# Altium schematic sheet AD_3_V1_01.SchDoc
size A2; Date: Date; CompanyName: HESSO; Engineer: Name; Address1: Route du Rawyl 47; Address2: 1950 Sion; Address3: Switzerland; DocumentNumber: 3; SheetNumber: 3; SheetTotal: 6; ProjectName: Project Name
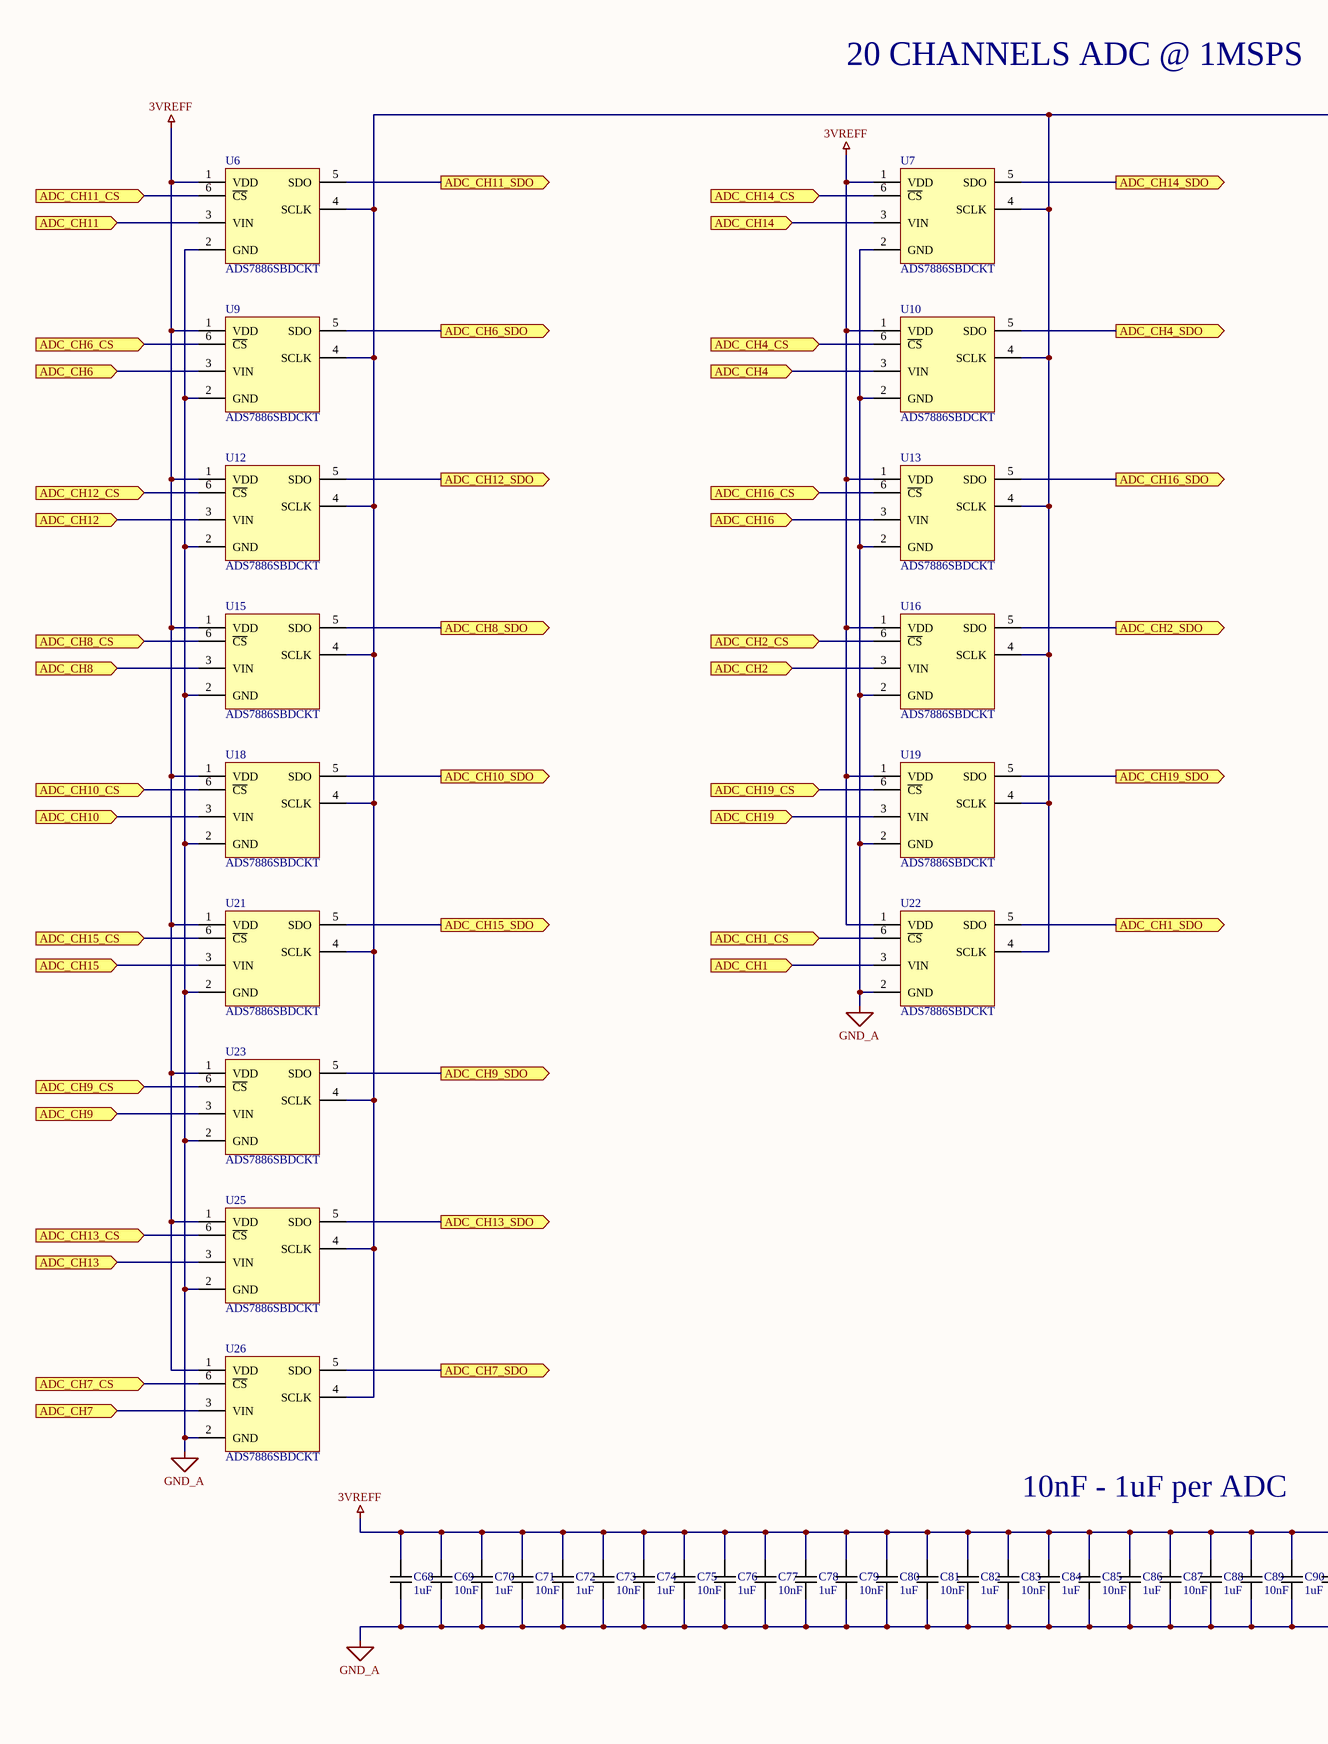
[diagram p0: AD_3_V1_01.SchDoc, left]
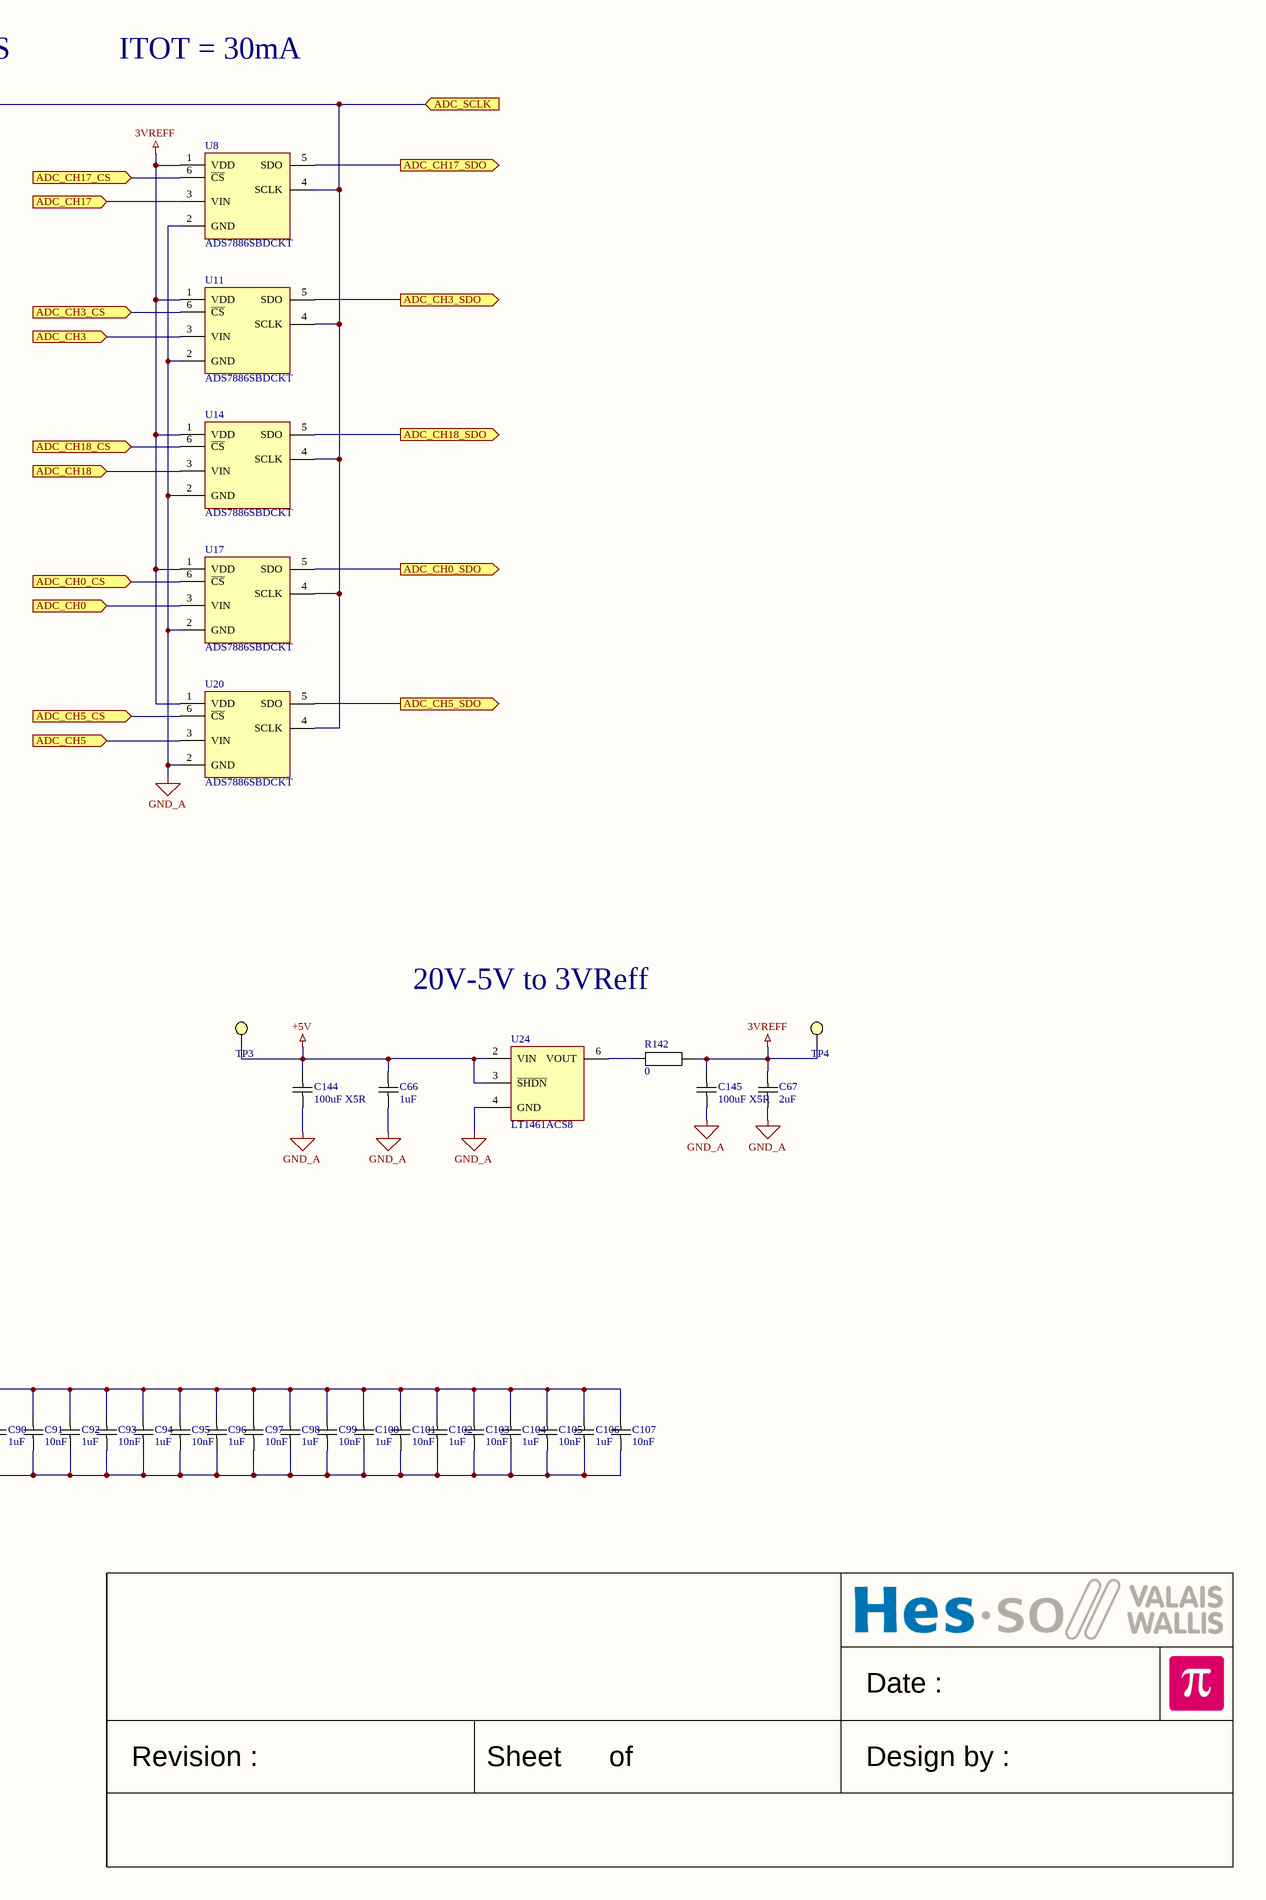
[diagram p1: AD_3_V1_01.SchDoc, right]

## Parts
C66  1uF  [CAPACITOR 1608 REFLOW]
C67  2uF  [CAPACITOR 1608 REFLOW]
C68  1uF  [CAPACITOR 1608 REFLOW]
C69  10nF  [CAPACITOR 1608 REFLOW]
C70  1uF  [CAPACITOR 1608 REFLOW]
C71  10nF  [CAPACITOR 1608 REFLOW]
C72  1uF  [CAPACITOR 1608 REFLOW]
C73  10nF  [CAPACITOR 1608 REFLOW]
C74  1uF  [CAPACITOR 1608 REFLOW]
C75  10nF  [CAPACITOR 1608 REFLOW]
C76  1uF  [CAPACITOR 1608 REFLOW]
C77  10nF  [CAPACITOR 1608 REFLOW]
C78  1uF  [CAPACITOR 1608 REFLOW]
C79  10nF  [CAPACITOR 1608 REFLOW]
C80  1uF  [CAPACITOR 1608 REFLOW]
C81  10nF  [CAPACITOR 1608 REFLOW]
C82  1uF  [CAPACITOR 1608 REFLOW]
C83  10nF  [CAPACITOR 1608 REFLOW]
C84  1uF  [CAPACITOR 1608 REFLOW]
C85  10nF  [CAPACITOR 1608 REFLOW]
C86  1uF  [CAPACITOR 1608 REFLOW]
C87  10nF  [CAPACITOR 1608 REFLOW]
C88  1uF  [CAPACITOR 1608 REFLOW]
C89  10nF  [CAPACITOR 1608 REFLOW]
C90  1uF  [CAPACITOR 1608 REFLOW]
C91  10nF  [CAPACITOR 1608 REFLOW]
C92  1uF  [CAPACITOR 1608 REFLOW]
C93  10nF  [CAPACITOR 1608 REFLOW]
C94  1uF  [CAPACITOR 1608 REFLOW]
C95  10nF  [CAPACITOR 1608 REFLOW]
C96  1uF  [CAPACITOR 1608 REFLOW]
C97  10nF  [CAPACITOR 1608 REFLOW]
C98  1uF  [CAPACITOR 1608 REFLOW]
C99  10nF  [CAPACITOR 1608 REFLOW]
C100  1uF  [CAPACITOR 1608 REFLOW]
C101  10nF  [CAPACITOR 1608 REFLOW]
C102  1uF  [CAPACITOR 1608 REFLOW]
C103  10nF  [CAPACITOR 1608 REFLOW]
C104  1uF  [CAPACITOR 1608 REFLOW]
C105  10nF  [CAPACITOR 1608 REFLOW]
C106  1uF  [CAPACITOR 1608 REFLOW]
C107  10nF  [CAPACITOR 1608 REFLOW]
C144  100uF X5R  [CAPACITOR 3216 REFLOW]
C145  100uF X5R  [CAPACITOR 3216 REFLOW]
R142  0  [RESISTOR 1608 REFLOW]
TP3  *  [Test Point Keystone Miniature RED]  (value not drawn)
TP4  *  [Test Point Keystone Miniature RED]  (value not drawn)
U6  ADS7886SBDCKT  [SOT23-6 P0.95 C1.5x3.0 H1.3]
U7  ADS7886SBDCKT  [SOT23-6 P0.95 C1.5x3.0 H1.3]
U8  ADS7886SBDCKT  [SOT23-6 P0.95 C1.5x3.0 H1.3]
U9  ADS7886SBDCKT  [SOT23-6 P0.95 C1.5x3.0 H1.3]
U10  ADS7886SBDCKT  [SOT23-6 P0.95 C1.5x3.0 H1.3]
U11  ADS7886SBDCKT  [SOT23-6 P0.95 C1.5x3.0 H1.3]
U12  ADS7886SBDCKT  [SOT23-6 P0.95 C1.5x3.0 H1.3]
U13  ADS7886SBDCKT  [SOT23-6 P0.95 C1.5x3.0 H1.3]
U14  ADS7886SBDCKT  [SOT23-6 P0.95 C1.5x3.0 H1.3]
U15  ADS7886SBDCKT  [SOT23-6 P0.95 C1.5x3.0 H1.3]
U16  ADS7886SBDCKT  [SOT23-6 P0.95 C1.5x3.0 H1.3]
U17  ADS7886SBDCKT  [SOT23-6 P0.95 C1.5x3.0 H1.3]
U18  ADS7886SBDCKT  [SOT23-6 P0.95 C1.5x3.0 H1.3]
U19  ADS7886SBDCKT  [SOT23-6 P0.95 C1.5x3.0 H1.3]
U20  ADS7886SBDCKT  [SOT23-6 P0.95 C1.5x3.0 H1.3]
U21  ADS7886SBDCKT  [SOT23-6 P0.95 C1.5x3.0 H1.3]
U22  ADS7886SBDCKT  [SOT23-6 P0.95 C1.5x3.0 H1.3]
U23  ADS7886SBDCKT  [SOT23-6 P0.95 C1.5x3.0 H1.3]
U24  LT1461ACS8  [SO8 P1.27 C4.0X5.0 H1.75]
U25  ADS7886SBDCKT  [SOT23-6 P0.95 C1.5x3.0 H1.3]
U26  ADS7886SBDCKT  [SOT23-6 P0.95 C1.5x3.0 H1.3]

## Ports
ADC_CH0 (in), ADC_CH0_CS (in), ADC_CH0_SDO (out), ADC_CH1 (in), ADC_CH1_CS (in), ADC_CH1_SDO (out), ADC_CH2 (in), ADC_CH2_CS (in), ADC_CH2_SDO (out), ADC_CH3 (in), ADC_CH3_CS (in), ADC_CH3_SDO (out), ADC_CH4 (in), ADC_CH4_CS (in), ADC_CH4_SDO (out), ADC_CH5 (in), ADC_CH5_CS (in), ADC_CH5_SDO (out), ADC_CH6 (in), ADC_CH6_CS (in), ADC_CH6_SDO (out), ADC_CH7 (in), ADC_CH7_CS (in), ADC_CH7_SDO (out), ADC_CH8 (in), ADC_CH8_CS (in), ADC_CH8_SDO (out), ADC_CH9 (in), ADC_CH9_CS (in), ADC_CH9_SDO (out), ADC_CH10 (in), ADC_CH10_CS (in), ADC_CH10_SDO (out), ADC_CH11 (in), ADC_CH11_CS (in), ADC_CH11_SDO (out), ADC_CH12 (in), ADC_CH12_CS (in), ADC_CH12_SDO (out), ADC_CH13 (in), ADC_CH13_CS (in), ADC_CH13_SDO (out), ADC_CH14 (in), ADC_CH14_CS (in), ADC_CH14_SDO (out), ADC_CH15 (in), ADC_CH15_CS (in), ADC_CH15_SDO (out), ADC_CH16 (in), ADC_CH16_CS (in), ADC_CH16_SDO (out), ADC_CH17 (in), ADC_CH17_CS (in), ADC_CH17_SDO (out), ADC_CH18 (in), ADC_CH18_CS (in), ADC_CH18_SDO (out), ADC_CH19 (in), ADC_CH19_CS (in), ADC_CH19_SDO (out), ADC_SCLK (in)

## Nets
3VREFF: C67.2 C68.2 C69.2 C70.2 C71.2 C72.2 C73.2 C74.2 C75.2 C76.2 C77.2 C78.2 C79.2 C80.2 C81.2 C82.2 C83.2 C84.2 C85.2 C86.2 C87.2 C88.2 C89.2 C90.2 C91.2 C92.2 C93.2 C94.2 C95.2 C96.2 C97.2 C98.2 C99.2 C100.2 C101.2 C102.2 C103.2 C104.2 C105.2 C106.2 C107.2 C145.2 R142.2 TP4.1 U6.1(VDD) U7.1(VDD) U8.1(VDD) U9.1(VDD) U10.1(VDD) U11.1(VDD) U12.1(VDD) U13.1(VDD) U14.1(VDD) U15.1(VDD) U16.1(VDD) U17.1(VDD) U18.1(VDD) U19.1(VDD) U20.1(VDD) U21.1(VDD) U22.1(VDD) U23.1(VDD) U25.1(VDD) U26.1(VDD)
+5V: C66.2 C144.2 TP3.1 U24.2(VIN) U24.3(~{SHDN})
GND_A: C66.1 C67.1 C68.1 C69.1 C70.1 C71.1 C72.1 C73.1 C74.1 C75.1 C76.1 C77.1 C78.1 C79.1 C80.1 C81.1 C82.1 C83.1 C84.1 C85.1 C86.1 C87.1 C88.1 C89.1 C90.1 C91.1 C92.1 C93.1 C94.1 C95.1 C96.1 C97.1 C98.1 C99.1 C100.1 C101.1 C102.1 C103.1 C104.1 C105.1 C106.1 C107.1 C144.1 C145.1 U6.2(GND) U7.2(GND) U8.2(GND) U9.2(GND) U10.2(GND) U11.2(GND) U12.2(GND) U13.2(GND) U14.2(GND) U15.2(GND) U16.2(GND) U17.2(GND) U18.2(GND) U19.2(GND) U20.2(GND) U21.2(GND) U22.2(GND) U23.2(GND) U24.4(GND) U25.2(GND) U26.2(GND)
ADC_CH0: U17.3(VIN) ; port ADC_CH0
ADC_CH0_CS: U17.6(~{CS}) ; port ADC_CH0_CS
ADC_CH0_SDO: U17.5(SDO) ; port ADC_CH0_SDO
ADC_CH1: U22.3(VIN) ; port ADC_CH1
ADC_CH1_CS: U22.6(~{CS}) ; port ADC_CH1_CS
ADC_CH1_SDO: U22.5(SDO) ; port ADC_CH1_SDO
ADC_CH2: U16.3(VIN) ; port ADC_CH2
ADC_CH2_CS: U16.6(~{CS}) ; port ADC_CH2_CS
ADC_CH2_SDO: U16.5(SDO) ; port ADC_CH2_SDO
ADC_CH3: U11.3(VIN) ; port ADC_CH3
ADC_CH3_CS: U11.6(~{CS}) ; port ADC_CH3_CS
ADC_CH3_SDO: U11.5(SDO) ; port ADC_CH3_SDO
ADC_CH4: U10.3(VIN) ; port ADC_CH4
ADC_CH4_CS: U10.6(~{CS}) ; port ADC_CH4_CS
ADC_CH4_SDO: U10.5(SDO) ; port ADC_CH4_SDO
ADC_CH5: U20.3(VIN) ; port ADC_CH5
ADC_CH5_CS: U20.6(~{CS}) ; port ADC_CH5_CS
ADC_CH5_SDO: U20.5(SDO) ; port ADC_CH5_SDO
ADC_CH6: U9.3(VIN) ; port ADC_CH6
ADC_CH6_CS: U9.6(~{CS}) ; port ADC_CH6_CS
ADC_CH6_SDO: U9.5(SDO) ; port ADC_CH6_SDO
ADC_CH7: U26.3(VIN) ; port ADC_CH7
ADC_CH7_CS: U26.6(~{CS}) ; port ADC_CH7_CS
ADC_CH7_SDO: U26.5(SDO) ; port ADC_CH7_SDO
ADC_CH8: U15.3(VIN) ; port ADC_CH8
ADC_CH8_CS: U15.6(~{CS}) ; port ADC_CH8_CS
ADC_CH8_SDO: U15.5(SDO) ; port ADC_CH8_SDO
ADC_CH9: U23.3(VIN) ; port ADC_CH9
ADC_CH9_CS: U23.6(~{CS}) ; port ADC_CH9_CS
ADC_CH9_SDO: U23.5(SDO) ; port ADC_CH9_SDO
ADC_CH10: U18.3(VIN) ; port ADC_CH10
ADC_CH10_CS: U18.6(~{CS}) ; port ADC_CH10_CS
ADC_CH10_SDO: U18.5(SDO) ; port ADC_CH10_SDO
ADC_CH11: U6.3(VIN) ; port ADC_CH11
ADC_CH11_CS: U6.6(~{CS}) ; port ADC_CH11_CS
ADC_CH11_SDO: U6.5(SDO) ; port ADC_CH11_SDO
ADC_CH12: U12.3(VIN) ; port ADC_CH12
ADC_CH12_CS: U12.6(~{CS}) ; port ADC_CH12_CS
ADC_CH12_SDO: U12.5(SDO) ; port ADC_CH12_SDO
ADC_CH13: U25.3(VIN) ; port ADC_CH13
ADC_CH13_CS: U25.6(~{CS}) ; port ADC_CH13_CS
ADC_CH13_SDO: U25.5(SDO) ; port ADC_CH13_SDO
ADC_CH14: U7.3(VIN) ; port ADC_CH14
ADC_CH14_CS: U7.6(~{CS}) ; port ADC_CH14_CS
ADC_CH14_SDO: U7.5(SDO) ; port ADC_CH14_SDO
ADC_CH15: U21.3(VIN) ; port ADC_CH15
ADC_CH15_CS: U21.6(~{CS}) ; port ADC_CH15_CS
ADC_CH15_SDO: U21.5(SDO) ; port ADC_CH15_SDO
ADC_CH16: U13.3(VIN) ; port ADC_CH16
ADC_CH16_CS: U13.6(~{CS}) ; port ADC_CH16_CS
ADC_CH16_SDO: U13.5(SDO) ; port ADC_CH16_SDO
ADC_CH17: U8.3(VIN) ; port ADC_CH17
ADC_CH17_CS: U8.6(~{CS}) ; port ADC_CH17_CS
ADC_CH17_SDO: U8.5(SDO) ; port ADC_CH17_SDO
ADC_CH18: U14.3(VIN) ; port ADC_CH18
ADC_CH18_CS: U14.6(~{CS}) ; port ADC_CH18_CS
ADC_CH18_SDO: U14.5(SDO) ; port ADC_CH18_SDO
ADC_CH19: U19.3(VIN) ; port ADC_CH19
ADC_CH19_CS: U19.6(~{CS}) ; port ADC_CH19_CS
ADC_CH19_SDO: U19.5(SDO) ; port ADC_CH19_SDO
ADC_SCLK: U6.4(SCLK) U7.4(SCLK) U8.4(SCLK) U9.4(SCLK) U10.4(SCLK) U11.4(SCLK) U12.4(SCLK) U13.4(SCLK) U14.4(SCLK) U15.4(SCLK) U16.4(SCLK) U17.4(SCLK) U18.4(SCLK) U19.4(SCLK) U20.4(SCLK) U21.4(SCLK) U22.4(SCLK) U23.4(SCLK) U25.4(SCLK) U26.4(SCLK) ; port ADC_SCLK
NetR142_1: R142.1 U24.6(VOUT)

## Notes on the sheet
- 20 CHANNELS ADC @ 1MSPS
- ITOT = 30mA
- 20V-5V to 3VReff
- 10nF - 1uF per ADC
- Date :
- Revision :
- Sheet
- of
- Design by :

## Library data of the parts
C66-C107 C144 C145 = Capacitor
  C66 C68 C70 C72 C74 C76 C78 C80 C82 C84 C86 C88 C90 C92 C94 C96 C98 C100 C102 C104 C106: Value: 1uF
  C67: Value: 2uF
  C69 C71 C73 C75 C77 C79 C81 C83 C85 C87 C89 C91 C93 C95 C97 C99 C101 C103 C105 C107: Value: 10nF
  C144 C145: Value: 100uF X5R
R142 = Resistor: Resistor 1% 50V 100mW 1608(0603); Value: 0
TP3 TP4 = Test Point: Value: *
U6-U23 U25 U26 = ADS7886SBDCKT: 12-Bit, 1-MSPS, Micro-Power, Miniature SAR Analog-to-Digital Converters; Value: ADS7886SBDCKT
U24 = LT1461ACS8: Micropower Precision Low Dropout Series Voltage Reference Family; Value: LT1461ACS8